# Altium schematic sheet 10-CONNECTOR.SchDoc
size A4
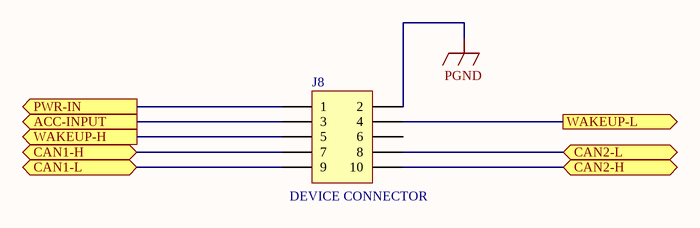
[diagram p0: 10-CONNECTOR.SchDoc]

## Parts
J8  DEVICE CONNECTOR  [5557-10P]

## Ports
ACC-INPUT (out), CAN1-H (bidir), CAN1-L (bidir), CAN2-H (bidir), CAN2-L (bidir), PWR-IN (out), WAKEUP-H (out), WAKEUP-L (out)

## Nets
PGND: J8.2
ACC-INPUT: J8.3 ; port ACC-INPUT
CAN1-H: J8.7 ; port CAN1-H
CAN1-L: J8.9 ; port CAN1-L
CAN2-H: J8.10 ; port CAN2-H
CAN2-L: J8.8 ; port CAN2-L
PWR-IN: J8.1 ; port PWR-IN
WAKEUP-H: J8.5 ; port WAKEUP-H
WAKEUP-L: J8.4 ; port WAKEUP-L

Not connected (* = marked no-connect by the designer): J8 6

## Library data of the parts
J8 = Header 5X2H: Header, 5-Pin, Dual row, Right Angle; LatestRevisionDate: 17-Jul-2002; LatestRevisionNote: Re-released for DXP Platform.; Publisher: Altium Limited